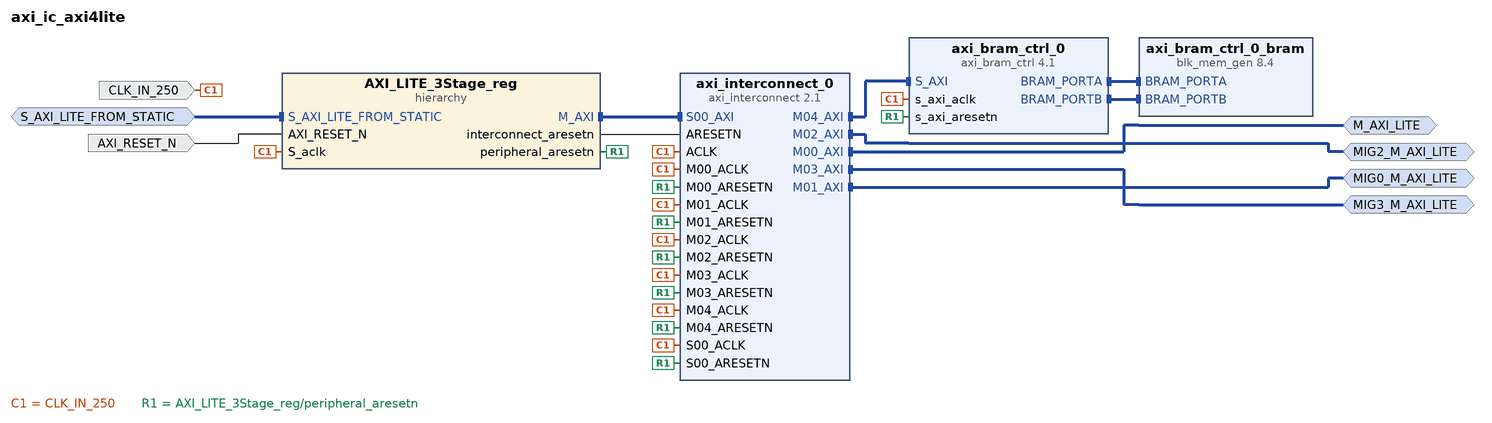
[diagram p0: block diagram of the top level]
# Vivado block design axi_ic_axi4lite, xcu200-fsgd2104-2-e, Vivado 2019.2
create_bd_design axi_ic_axi4lite

create_bd_intf_port -mode Slave -vlnv xilinx.com:interface:aximm_rtl:1.0 S_AXI_LITE_FROM_STATIC
set_property -dict [list \
  CONFIG.DATA_WIDTH 32 \
  CONFIG.PROTOCOL AXI4LITE \
  CONFIG.FREQ_HZ 250000000 \
  CONFIG.ID_WIDTH 0 \
  CONFIG.ADDR_WIDTH 32 \
  CONFIG.AWUSER_WIDTH 0 \
  CONFIG.ARUSER_WIDTH 0 \
  CONFIG.WUSER_WIDTH 0 \
  CONFIG.RUSER_WIDTH 0 \
  CONFIG.BUSER_WIDTH 0 \
  CONFIG.READ_WRITE_MODE READ_WRITE \
  CONFIG.HAS_BURST 0 \
  CONFIG.HAS_LOCK 0 \
  CONFIG.HAS_PROT 1 \
  CONFIG.HAS_CACHE 0 \
  CONFIG.HAS_QOS 0 \
  CONFIG.HAS_REGION 0 \
  CONFIG.HAS_WSTRB 1 \
  CONFIG.HAS_BRESP 1 \
  CONFIG.HAS_RRESP 1 \
  CONFIG.SUPPORTS_NARROW_BURST 0 \
  CONFIG.NUM_READ_OUTSTANDING 1 \
  CONFIG.NUM_WRITE_OUTSTANDING 1 \
  CONFIG.MAX_BURST_LENGTH 1 \
  CONFIG.CLK_DOMAIN PCIe_Bridge_ICAP_complex_xdma_0_0_axi_aclk \
  CONFIG.NUM_READ_THREADS 1 \
  CONFIG.NUM_WRITE_THREADS 1 \
  CONFIG.RUSER_BITS_PER_BYTE 0 \
  CONFIG.WUSER_BITS_PER_BYTE 0 \
] [get_bd_intf_ports S_AXI_LITE_FROM_STATIC]
create_bd_intf_port -mode Master -vlnv xilinx.com:interface:aximm_rtl:1.0 M_AXI_LITE
set_property -dict [list \
  CONFIG.DATA_WIDTH 32 \
  CONFIG.PROTOCOL AXI4LITE \
  CONFIG.FREQ_HZ 250000000 \
  CONFIG.ADDR_WIDTH 32 \
  CONFIG.HAS_BURST 0 \
  CONFIG.HAS_LOCK 0 \
  CONFIG.HAS_CACHE 0 \
  CONFIG.HAS_QOS 0 \
  CONFIG.HAS_REGION 0 \
  CONFIG.SUPPORTS_NARROW_BURST 0 \
  CONFIG.NUM_READ_OUTSTANDING 1 \
  CONFIG.NUM_WRITE_OUTSTANDING 1 \
  CONFIG.MAX_BURST_LENGTH 1 \
  CONFIG.CLK_DOMAIN PCIe_Bridge_ICAP_complex_xdma_0_0_axi_aclk \
] [get_bd_intf_ports M_AXI_LITE]
create_bd_intf_port -mode Master -vlnv xilinx.com:interface:aximm_rtl:1.0 MIG0_M_AXI_LITE
set_property -dict [list \
  CONFIG.DATA_WIDTH 32 \
  CONFIG.PROTOCOL AXI4LITE \
  CONFIG.FREQ_HZ 250000000 \
  CONFIG.ADDR_WIDTH 32 \
  CONFIG.HAS_BURST 0 \
  CONFIG.HAS_LOCK 0 \
  CONFIG.HAS_CACHE 0 \
  CONFIG.HAS_QOS 0 \
  CONFIG.HAS_REGION 0 \
  CONFIG.SUPPORTS_NARROW_BURST 0 \
  CONFIG.NUM_READ_OUTSTANDING 1 \
  CONFIG.NUM_WRITE_OUTSTANDING 1 \
  CONFIG.MAX_BURST_LENGTH 1 \
  CONFIG.CLK_DOMAIN PCIe_Bridge_ICAP_complex_xdma_0_0_axi_aclk \
] [get_bd_intf_ports MIG0_M_AXI_LITE]
create_bd_intf_port -mode Master -vlnv xilinx.com:interface:aximm_rtl:1.0 MIG2_M_AXI_LITE
set_property -dict [list \
  CONFIG.DATA_WIDTH 32 \
  CONFIG.PROTOCOL AXI4LITE \
  CONFIG.FREQ_HZ 250000000 \
  CONFIG.ADDR_WIDTH 32 \
  CONFIG.HAS_BURST 0 \
  CONFIG.HAS_LOCK 0 \
  CONFIG.HAS_CACHE 0 \
  CONFIG.HAS_QOS 0 \
  CONFIG.HAS_REGION 0 \
  CONFIG.SUPPORTS_NARROW_BURST 0 \
  CONFIG.NUM_READ_OUTSTANDING 1 \
  CONFIG.NUM_WRITE_OUTSTANDING 1 \
  CONFIG.MAX_BURST_LENGTH 1 \
  CONFIG.CLK_DOMAIN PCIe_Bridge_ICAP_complex_xdma_0_0_axi_aclk \
] [get_bd_intf_ports MIG2_M_AXI_LITE]
create_bd_intf_port -mode Master -vlnv xilinx.com:interface:aximm_rtl:1.0 MIG3_M_AXI_LITE
set_property -dict [list \
  CONFIG.DATA_WIDTH 32 \
  CONFIG.PROTOCOL AXI4LITE \
  CONFIG.FREQ_HZ 250000000 \
  CONFIG.ADDR_WIDTH 32 \
  CONFIG.HAS_BURST 0 \
  CONFIG.HAS_LOCK 0 \
  CONFIG.HAS_CACHE 0 \
  CONFIG.HAS_QOS 0 \
  CONFIG.HAS_REGION 0 \
  CONFIG.SUPPORTS_NARROW_BURST 0 \
  CONFIG.NUM_READ_OUTSTANDING 1 \
  CONFIG.NUM_WRITE_OUTSTANDING 1 \
  CONFIG.MAX_BURST_LENGTH 1 \
  CONFIG.CLK_DOMAIN PCIe_Bridge_ICAP_complex_xdma_0_0_axi_aclk \
] [get_bd_intf_ports MIG3_M_AXI_LITE]
create_bd_port -dir I -type rst AXI_RESET_N
create_bd_port -dir I -type clk CLK_IN_250
set_property -dict [list \
  CONFIG.ASSOCIATED_BUSIF S_AXI_LITE_FROM_STATIC:M_AXI_LITE:MIG0_M_AXI_LITE:MIG2_M_AXI_LITE:MIG3_M_AXI_LITE \
  CONFIG.ASSOCIATED_RESET AXI_RESET_N \
  CONFIG.CLK_DOMAIN PCIe_Bridge_ICAP_complex_xdma_0_0_axi_aclk \
  CONFIG.FREQ_HZ 250000000 \
] [get_bd_ports CLK_IN_250]

create_bd_cell -type hier AXI_LITE_3Stage_reg
create_bd_cell -type ip -vlnv xilinx.com:ip:axi_bram_ctrl:4.1 axi_bram_ctrl_0
create_bd_cell -type ip -vlnv xilinx.com:ip:blk_mem_gen:8.4 axi_bram_ctrl_0_bram
set_property -dict [list \
  CONFIG.Enable_B Use_ENB_Pin \
  CONFIG.Memory_Type True_Dual_Port_RAM \
  CONFIG.Port_B_Clock 100 \
  CONFIG.Port_B_Enable_Rate 100 \
  CONFIG.Port_B_Write_Rate 50 \
  CONFIG.Use_RSTB_Pin true \
] [get_bd_cells axi_bram_ctrl_0_bram]
create_bd_cell -type ip -vlnv xilinx.com:ip:axi_interconnect:2.1 axi_interconnect_0
set_property -dict [list \
  CONFIG.M00_HAS_REGSLICE 4 \
  CONFIG.M01_HAS_REGSLICE 4 \
  CONFIG.M02_HAS_REGSLICE 4 \
  CONFIG.M03_HAS_REGSLICE 4 \
  CONFIG.NUM_MI 5 \
  CONFIG.S00_HAS_REGSLICE 4 \
  CONFIG.STRATEGY 1 \
] [get_bd_cells axi_interconnect_0]

# ---- hierarchy /AXI_LITE_3Stage_reg ----
current_bd_instance /AXI_LITE_3Stage_reg
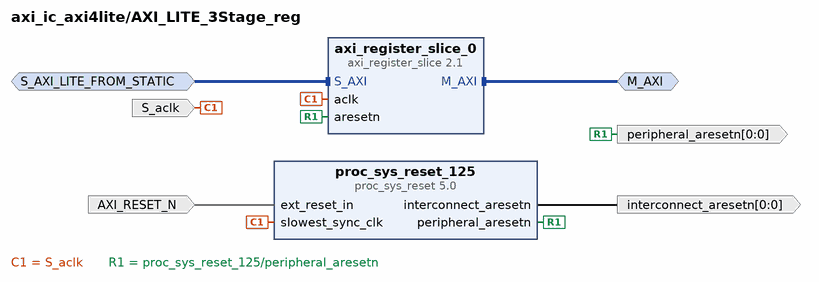
[diagram p1: block diagram inside /AXI_LITE_3Stage_reg]
create_bd_intf_pin -mode Slave -vlnv xilinx.com:interface:aximm_rtl:1.0 S_AXI_LITE_FROM_STATIC
create_bd_intf_pin -mode Master -vlnv xilinx.com:interface:aximm_rtl:1.0 M_AXI
create_bd_pin -dir I -type rst AXI_RESET_N
create_bd_pin -dir I -type clk S_aclk
create_bd_pin -dir O -from 0 -to 0 -type rst peripheral_aresetn
create_bd_pin -dir O -from 0 -to 0 -type rst interconnect_aresetn

create_bd_cell -type ip -vlnv xilinx.com:ip:proc_sys_reset:5.0 proc_sys_reset_125
create_bd_cell -type ip -vlnv xilinx.com:ip:axi_register_slice:2.1 axi_register_slice_0
set_property -dict {CONFIG.REG_R 7 CONFIG.REG_W 7} [get_bd_cells axi_register_slice_0]

# ---- connections ----

current_bd_instance /AXI_LITE_3Stage_reg
connect_bd_intf_net [get_bd_intf_pins S_AXI_LITE_FROM_STATIC] [get_bd_intf_pins axi_register_slice_0/S_AXI]
connect_bd_intf_net [get_bd_intf_pins M_AXI] [get_bd_intf_pins axi_register_slice_0/M_AXI]
connect_bd_net [get_bd_pins AXI_RESET_N] [get_bd_pins proc_sys_reset_125/ext_reset_in]
connect_bd_net -net aclk_1 [get_bd_pins S_aclk] [get_bd_pins proc_sys_reset_125/slowest_sync_clk] [get_bd_pins axi_register_slice_0/aclk]
connect_bd_net -net aresetn_1 [get_bd_pins proc_sys_reset_125/peripheral_aresetn] \
  [get_bd_pins peripheral_aresetn] [get_bd_pins axi_register_slice_0/aresetn]
connect_bd_net [get_bd_pins proc_sys_reset_125/interconnect_aresetn] [get_bd_pins interconnect_aresetn]

current_bd_instance /
connect_bd_intf_net [get_bd_intf_ports MIG2_M_AXI_LITE] [get_bd_intf_pins axi_interconnect_0/M02_AXI]
connect_bd_intf_net [get_bd_intf_ports MIG3_M_AXI_LITE] [get_bd_intf_pins axi_interconnect_0/M03_AXI]
connect_bd_intf_net [get_bd_intf_pins axi_bram_ctrl_0_bram/BRAM_PORTA] [get_bd_intf_pins axi_bram_ctrl_0/BRAM_PORTA]
connect_bd_intf_net [get_bd_intf_ports M_AXI_LITE] [get_bd_intf_pins axi_interconnect_0/M00_AXI]
connect_bd_intf_net [get_bd_intf_pins axi_interconnect_0/S00_AXI] [get_bd_intf_pins AXI_LITE_3Stage_reg/M_AXI]
connect_bd_intf_net [get_bd_intf_ports S_AXI_LITE_FROM_STATIC] [get_bd_intf_pins AXI_LITE_3Stage_reg/S_AXI_LITE_FROM_STATIC]
connect_bd_intf_net [get_bd_intf_ports MIG0_M_AXI_LITE] [get_bd_intf_pins axi_interconnect_0/M01_AXI]
connect_bd_intf_net [get_bd_intf_pins axi_bram_ctrl_0_bram/BRAM_PORTB] [get_bd_intf_pins axi_bram_ctrl_0/BRAM_PORTB]
connect_bd_intf_net [get_bd_intf_pins axi_interconnect_0/M04_AXI] [get_bd_intf_pins axi_bram_ctrl_0/S_AXI]
connect_bd_net [get_bd_ports AXI_RESET_N] [get_bd_pins AXI_LITE_3Stage_reg/AXI_RESET_N]
connect_bd_net -net CLK_IN_250_1 [get_bd_ports CLK_IN_250] \
  [get_bd_pins AXI_LITE_3Stage_reg/S_aclk] [get_bd_pins axi_bram_ctrl_0/s_axi_aclk] [get_bd_pins axi_interconnect_0/ACLK] \
  [get_bd_pins axi_interconnect_0/S00_ACLK] [get_bd_pins axi_interconnect_0/M00_ACLK] \
  [get_bd_pins axi_interconnect_0/M01_ACLK] [get_bd_pins axi_interconnect_0/M02_ACLK] \
  [get_bd_pins axi_interconnect_0/M03_ACLK] [get_bd_pins axi_interconnect_0/M04_ACLK]
connect_bd_net -net ARESETN_1 [get_bd_pins AXI_LITE_3Stage_reg/interconnect_aresetn] [get_bd_pins axi_interconnect_0/ARESETN]
connect_bd_net -net S00_ARESETN_1 [get_bd_pins AXI_LITE_3Stage_reg/peripheral_aresetn] \
  [get_bd_pins axi_bram_ctrl_0/s_axi_aresetn] [get_bd_pins axi_interconnect_0/S00_ARESETN] \
  [get_bd_pins axi_interconnect_0/M00_ARESETN] [get_bd_pins axi_interconnect_0/M01_ARESETN] \
  [get_bd_pins axi_interconnect_0/M02_ARESETN] [get_bd_pins axi_interconnect_0/M03_ARESETN] \
  [get_bd_pins axi_interconnect_0/M04_ARESETN]

# ---- address map ----
assign_bd_address -offset 0x00100000 -range 64K -target_address_space [get_bd_addr_spaces S_AXI_LITE_FROM_STATIC] [get_bd_addr_segs M_AXI_LITE/Reg]
assign_bd_address -offset 0x00120000 -range 128K -target_address_space [get_bd_addr_spaces S_AXI_LITE_FROM_STATIC] [get_bd_addr_segs MIG0_M_AXI_LITE/Reg]
assign_bd_address -offset 0x00140000 -range 128K -target_address_space [get_bd_addr_spaces S_AXI_LITE_FROM_STATIC] [get_bd_addr_segs MIG2_M_AXI_LITE/Reg]
assign_bd_address -offset 0x00160000 -range 128K -target_address_space [get_bd_addr_spaces S_AXI_LITE_FROM_STATIC] [get_bd_addr_segs MIG3_M_AXI_LITE/Reg]
assign_bd_address -offset 0x00180000 -range 4K -target_address_space [get_bd_addr_spaces S_AXI_LITE_FROM_STATIC] [get_bd_addr_segs axi_bram_ctrl_0/S_AXI/Mem0]

validate_bd_design
save_bd_design
